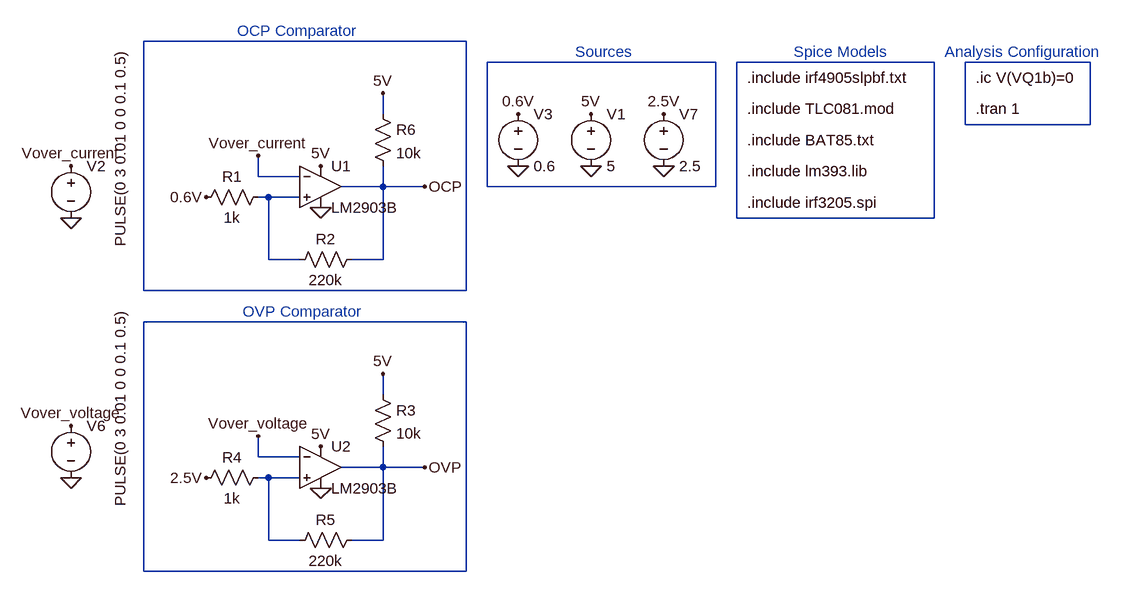
[diagram p0: schematic Charger_OVPOCP_Latch.asc]
Charger_OVPOCP_Latch.asc, the LTspice schematic file:
Version 4.1
SHEET 1 2496 816
WIRE 720 -320 224 -320
WIRE 1104 -288 752 -288
WIRE 1440 -288 1136 -288
WIRE 1680 -288 1488 -288
WIRE 592 -208 592 -240
WIRE 1488 -192 1488 -288
WIRE 1680 -192 1680 -288
WIRE 1680 -192 1488 -192
WIRE 400 -112 400 -144
WIRE 464 -112 400 -112
WIRE 592 -96 592 -128
WIRE 592 -96 528 -96
WIRE 656 -96 592 -96
WIRE 752 -96 752 -288
WIRE 1104 -96 1104 -288
WIRE 1104 -96 752 -96
WIRE 416 -80 400 -80
WIRE 464 -80 416 -80
WIRE 1136 -48 1136 -288
WIRE 1440 -48 1440 -288
WIRE 1440 -48 1136 -48
WIRE 416 16 416 -80
WIRE 464 16 416 16
WIRE 592 16 592 -96
WIRE 592 16 544 16
WIRE 224 64 224 -320
WIRE 720 64 720 -320
WIRE 720 64 224 64
WIRE 720 112 224 112
WIRE 592 224 592 192
WIRE 400 320 400 288
WIRE 464 320 400 320
WIRE 592 336 592 304
WIRE 592 336 528 336
WIRE 656 336 592 336
WIRE 416 352 400 352
WIRE 464 352 416 352
WIRE 416 448 416 352
WIRE 464 448 416 448
WIRE 592 448 592 336
WIRE 592 448 544 448
WIRE 224 496 224 112
WIRE 720 496 720 112
WIRE 720 496 224 496
FLAG 320 -80 0.6V
FLAG 496 -64 0
FLAG 656 -96 OCP
FLAG 112 -48 0
FLAG 112 -128 Vover_current
FLAG 400 -144 Vover_current
FLAG 800 -128 0
FLAG 800 -208 0.6V
FLAG 496 -128 5V
FLAG 592 -240 5V
FLAG 112 352 0
FLAG 112 272 Vover_voltage
FLAG 1024 -128 0
FLAG 1024 -208 2.5V
FLAG 912 -208 5V
FLAG 912 -128 0
FLAG 496 368 0
FLAG 496 304 5V
FLAG 592 192 5V
FLAG 320 352 2.5V
FLAG 656 336 OVP
FLAG 400 288 Vover_voltage
SYMBOL OpAmps\\opamp2 496 -160 R0
SYMATTR InstName U1
SYMATTR Value LM2903B
SYMBOL res 576 -224 R0
SYMATTR InstName R6
SYMATTR Value 10k
SYMBOL voltage 112 -144 R0
WINDOW 123 0 0 Left 0
WINDOW 39 0 0 Left 0
WINDOW 3 76 -163 VRight 2
SYMATTR Value PULSE(0 3 0.01 0 0 0.1 0.5)
SYMATTR InstName V2
SYMBOL voltage 800 -224 R0
WINDOW 123 0 0 Left 0
WINDOW 39 0 0 Left 0
SYMATTR InstName V3
SYMATTR Value 0.6
SYMBOL voltage 112 256 R0
WINDOW 123 0 0 Left 0
WINDOW 39 0 0 Left 0
WINDOW 3 76 -163 VRight 2
SYMATTR Value PULSE(0 3 0.01 0 0 0.1 0.5)
SYMATTR InstName V6
SYMBOL voltage 1024 -224 R0
WINDOW 123 0 0 Left 0
WINDOW 39 0 0 Left 0
SYMATTR InstName V7
SYMATTR Value 2.5
SYMBOL voltage 912 -224 R0
WINDOW 123 0 0 Left 0
WINDOW 39 0 0 Left 0
SYMATTR InstName V1
SYMATTR Value 5
SYMBOL res 416 -96 R90
WINDOW 0 0 56 VBottom 2
WINDOW 3 32 56 VTop 2
SYMATTR InstName R1
SYMATTR Value 1k
SYMBOL res 560 0 R90
WINDOW 0 0 56 VBottom 2
WINDOW 3 32 56 VTop 2
SYMATTR InstName R2
SYMATTR Value 220k
SYMBOL OpAmps\\opamp2 496 272 R0
SYMATTR InstName U2
SYMATTR Value LM2903B
SYMBOL res 576 208 R0
SYMATTR InstName R3
SYMATTR Value 10k
SYMBOL res 416 336 R90
WINDOW 0 0 56 VBottom 2
WINDOW 3 32 56 VTop 2
SYMATTR InstName R4
SYMATTR Value 1k
SYMBOL res 560 432 R90
WINDOW 0 0 56 VBottom 2
WINDOW 3 32 56 VTop 2
SYMATTR InstName R5
SYMATTR Value 220k
TEXT 368 -336 Left 2 ;OCP Comparator
TEXT 1504 -216 Left 2 !.tran 1
TEXT 1152 -264 Left 2 !.include irf4905slpbf.txt
TEXT 1152 -216 Left 2 !.include TLC081.mod
TEXT 1152 -168 Left 2 !.include BAT85.txt
TEXT 1152 -120 Left 2 !.include lm393.lib
TEXT 1152 -72 Left 2 !.include irf3205.spi
TEXT 1504 -264 Left 2 !.ic V(VQ1b)=0
TEXT 376 96 Left 2 ;OVP Comparator
TEXT 1456 -304 Left 2 ;Analysis Configuration
TEXT 1224 -304 Left 2 ;Spice Models
TEXT 888 -304 Left 2 ;Sources

The netlist it stands for:
* Charger_OVPOCP_Latch.asc
X§U1 N005 Vover_current 5V 0 OCP LM2903B  ; pins In+ In- V+ V- OUT
R6 5V OCP 10k
V2 Vover_current 0 PULSE(0 3 0.01 0 0 0.1 0.5)
V3 0.6V 0 0.6
V6 Vover_voltage 0 PULSE(0 3 0.01 0 0 0.1 0.5)
V7 2.5V 0 2.5
V1 5V 0 5
R1 N005 0.6V 1k
R2 OCP N005 220k
X§U2 N007 Vover_voltage 5V 0 OVP LM2903B  ; pins In+ In- V+ V- OUT
R3 5V OVP 10k
R4 N007 2.5V 1k
R5 OVP N007 220k
* OCP Comparator
.tran 1
.include irf4905slpbf.txt
.include TLC081.mod
.include BAT85.txt
.include lm393.lib
.include irf3205.spi
.ic V(VQ1b)=0
* OVP Comparator
* Analysis Configuration
* Spice Models
* Sources
.backanno
.end